# Altium schematic sheet L-D5019-05-02.SchDoc: EVE Display-Adapter
size A3; Organization: Organization; Address1: Address1; Address2: Address2; Address3: Address3; Address4: Address4; DocumentNumber: 1; Revision: 2; SheetNumber: 1; SheetTotal: 1; PageSetup: Record=PageOptions|CenterHorizontal=True|CenterVertical=True|PrintScale=1.00|XCorrection=1.00|YCorrection=1.00|PrintKind=1|BorderSize=5000000|LeftOffset=0|BottomOffset=0|Orientation=2|PaperLength=1000|PaperWidth=1000|Scale=100|PaperSource=7|PrintQuality=-4|MediaType=1|DitherType=10|PaperKind=A3|PrintScaleMode=0
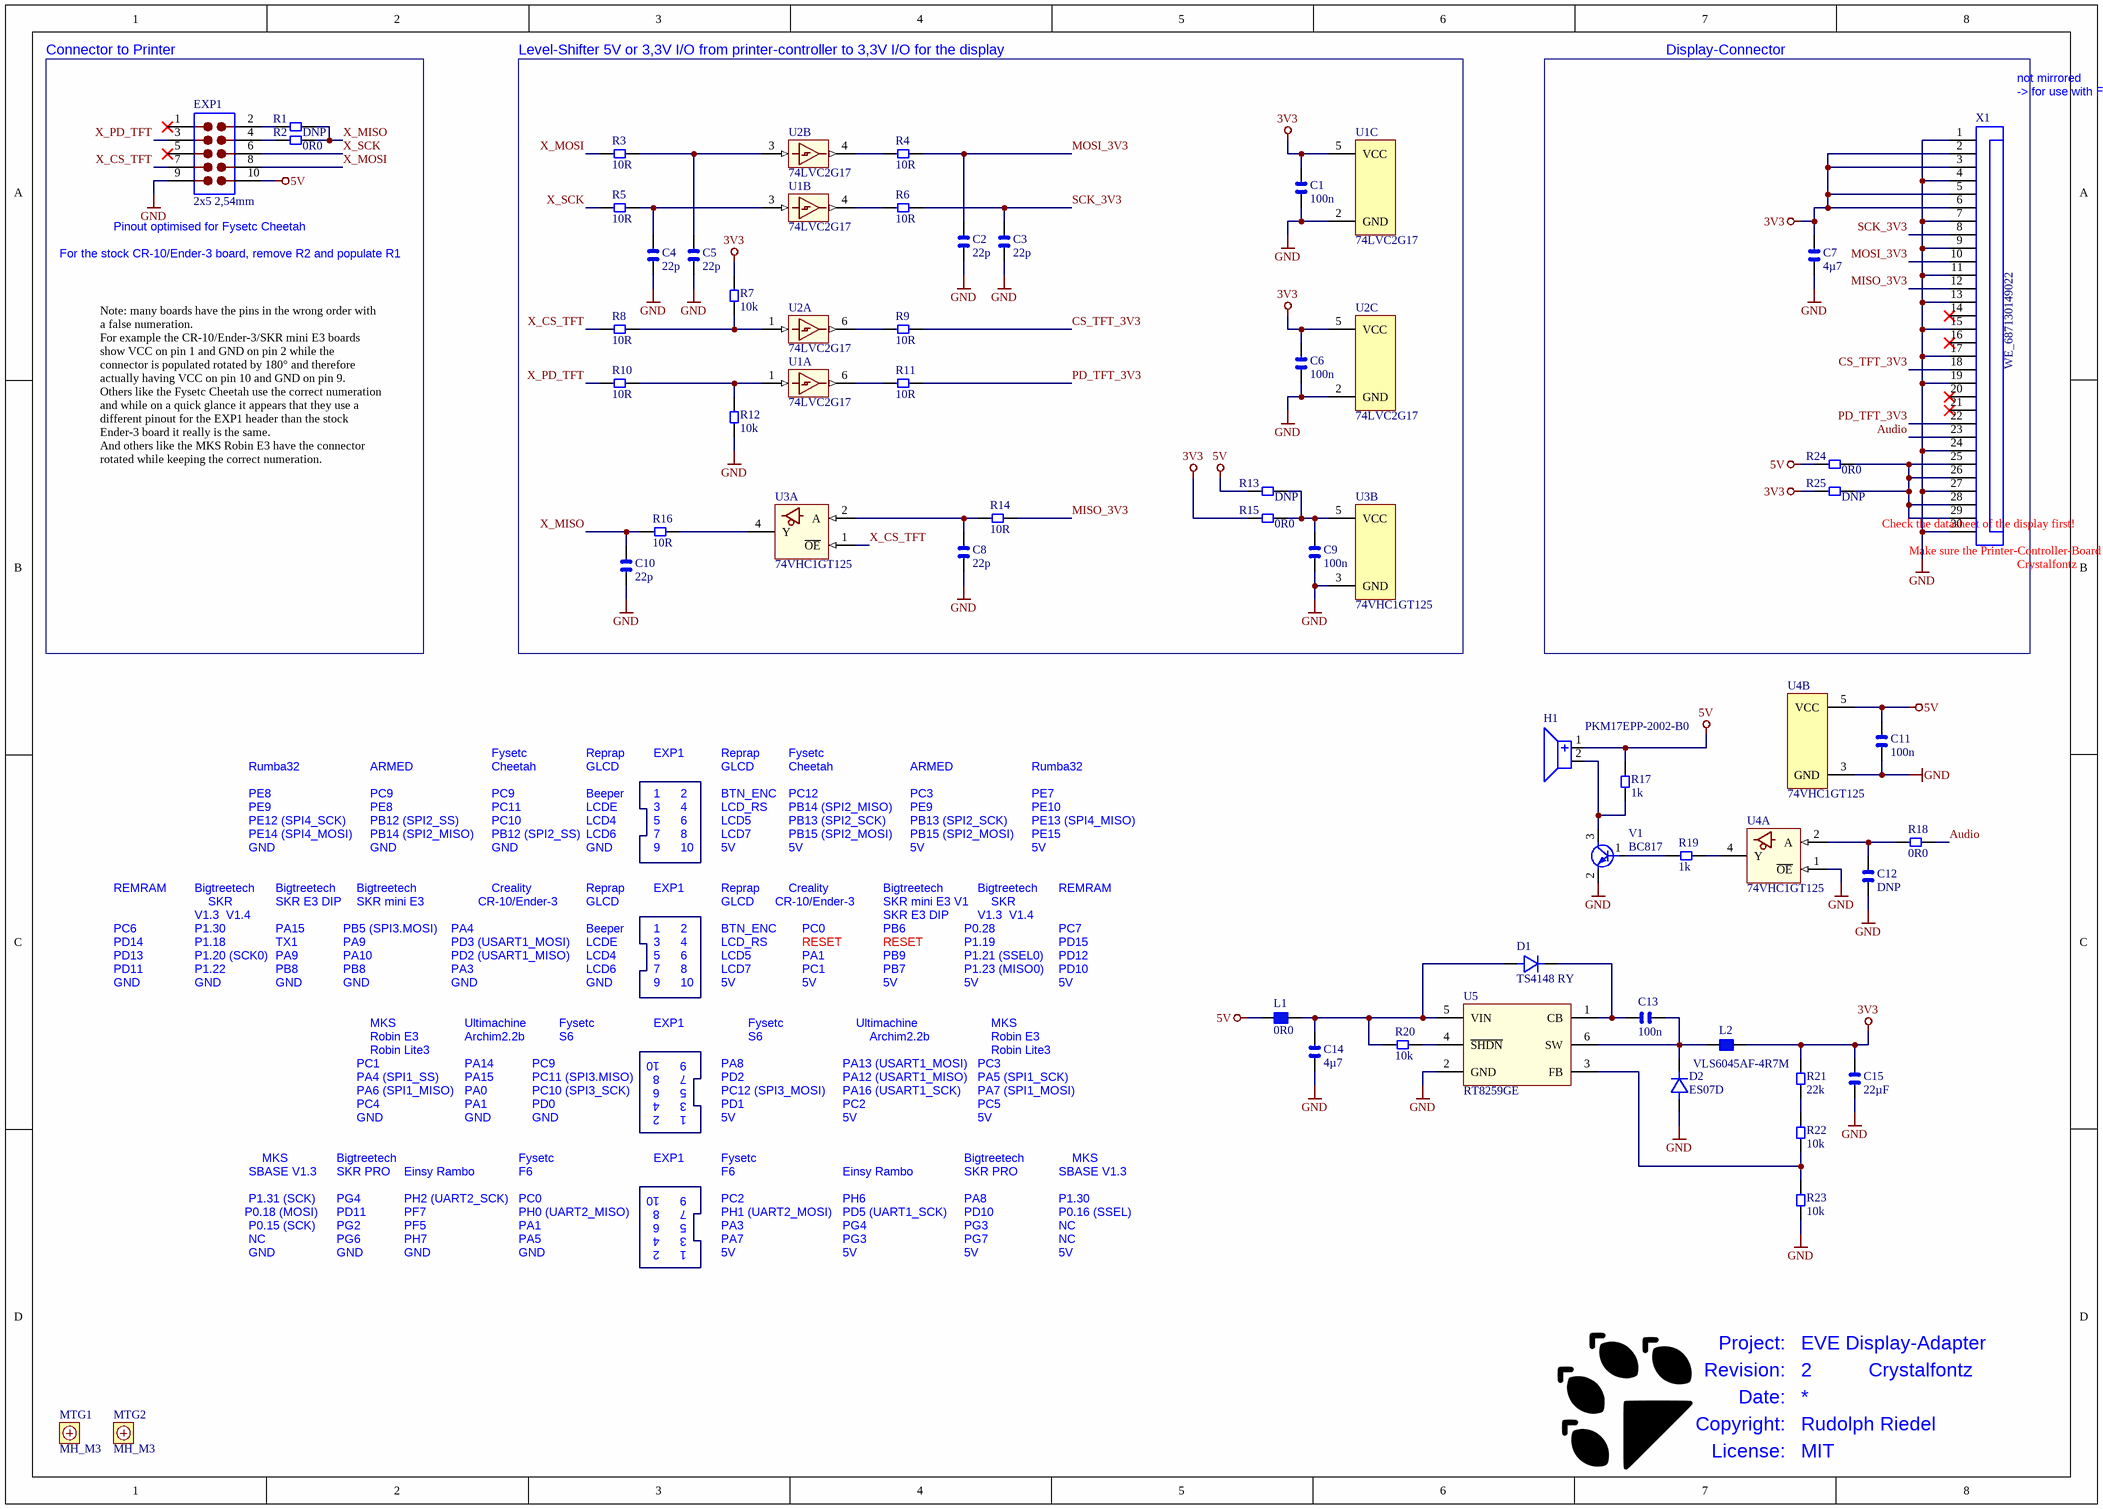
[diagram p0: L-D5019-05-02.SchDoc]

## Parts
C1  100n  [CAPC2012X14L]
C2  22p  [CAPC2012X14L]
C3  22p  [CAPC2012X14L]
C4  22p  [CAPC2012X14L]
C5  22p  [CAPC2012X14L]
C6  100n  [CAPC2012X14L]
C7  4µ7  [CAPC2012X14L]
C8  22p  [CAPC2012X14L]
C9  100n  [CAPC2012X14L]
C10  22p  [CAPC2012X14L]
C11  100n  [CAPC2012X14L]
C12  DNP  [CAPC2012X14L]
C13  100n  [CAPC2012X14L]
C14  4µ7  [CAPC2012X14L]
C15  22µF  [CAPC3216X19N]
D1  TS4148 RY  [DIOC2012X10N]
D2  ES07D  [DIOM2818X11N]
EXP1  2x5 2,54mm  [PINH_2x5_2_54mm_shroud]
H1  PKM17EPP-2002-B0  [Speaker_17mm]
L1  0R0  [INDC2012X10L]
L2  VLS6045AF-4R7M  [PowerInductor_6x6]
MTG1  MH_M3  [HOLE_3_2MM]  (no BOM)
MTG2  MH_M3  [HOLE_3_2MM]  (no BOM)
R1  DNP  [RESC2012X06L]
R2  0R0  [RESC2012X06L]
R3  10R  [RESC2012X06L]
R4  10R  [RESC2012X06L]
R5  10R  [RESC2012X06L]
R6  10R  [RESC2012X06L]
R7  10k  [RESC2012X06L]
R8  10R  [RESC2012X06L]
R9  10R  [RESC2012X06L]
R10  10R  [RESC2012X06L]
R11  10R  [RESC2012X06L]
R12  10k  [RESC2012X06L]
R13  DNP  [RESC2012X06L]
R14  10R  [RESC2012X06L]
R15  0R0  [RESC2012X06L]
R16  10R  [RESC2012X06L]
R17  1k  [RESC2012X06L]
R18  0R0  [RESC2012X06L]
R19  1k  [RESC2012X06L]
R20  10k  [RESC2012X06L]
R21  22k  [RESC2012X06L]
R22  10k  [RESC2012X06L]
R23  10k  [RESC2012X06L]
R24  0R0  [RESC2012X06L]
R25  DNP  [RESC2012X06L]
U1  74LVC2G17  [SOT95P280X110-6N]  (parts A,B,C of 3)
U2  74LVC2G17  [SOT95P280X110-6N]  (parts A,B,C of 3)
U3  74VHC1GT125  [SOT95P280X110-5N]  (parts A,B of 2)
U4  74VHC1GT125  [SOT95P280X110-5N]  (parts A,B of 2)
U5  RT8259GE  [SOT95P280X110-6N]
V1  BC817  [SOT95P280X110-3N]
X1  WE_687130149022  [WE_687130149022]

## Blocks framed on the sheet
Connector to Printer: EXP1 R1 R2
Display-Connector: C7 R24 R25 X1

## Nets
3V3: C1.2 C6.2 C7.2 C15.2 L2.2 R7.2 R15.1 R21.2 R25.1 U1.5(VCC) U2.5(VCC) X1.2 X1.3 X1.5 X1.6
5V: C11.2 EXP1.10 H1.1 L1.1 R13.1 R17.2 R24.1 U4.5(VCC)
GND: C1.1 C2.1 C3.1 C4.1 C5.1 C6.1 C7.1 C8.1 C9.1 C10.1 C11.1 C12.1 C14.1 C15.1 D2.2 EXP1.9 R12.1 R23.1 U1.2(GND) U2.2(GND) U3.3(GND) U4.1(~{OE}) U4.3(GND) U5.2(GND) V1.2 X1.1 X1.4 X1.7 X1.9 X1.11 X1.13 X1.15 X1.17 X1.19 X1.24 X1.27 X1.30
Audio: R18.2 X1.23
CS_TFT_3V3: R9.2 X1.18
MISO_3V3: R14.2 X1.12
MOSI_3V3: C2.2 R4.2 X1.10
PD_TFT_3V3: R11.2 X1.22
SCK_3V3: C3.2 R6.2 X1.8
X_CS_TFT: EXP1.7 R8.1 U3.1(~{OE})
X_MISO: C10.2 R1.2 R2.2 R16.1
X_MOSI: EXP1.8 R3.1
X_PD_TFT: EXP1.3 R10.1
X_SCK: EXP1.6 R5.1
NetC4_2: C4.2 R5.2 U1.3(2A)
NetC5_2: C5.2 R3.2 U2.3(2A)
NetC8_2: C8.2 R14.1 U3.2(A)
NetC9_2: C9.2 R13.2 R15.2 U3.5(VCC)
NetC12_2: C12.2 R18.1 U4.2(A)
NetC13_1: C13.1 D1.1 U5.1(CB)
NetC13_2: C13.2 D2.1 L2.1 U5.6(SW)
NetC14_2: C14.2 D1.2 L1.2 R20.1 U5.5(VIN)
NetEXP1_2: EXP1.2 R1.1
NetEXP1_4: EXP1.4 R2.1
NetH1_2: H1.2 R17.1 V1.3
NetR4_1: R4.1 U2.4(2Y)
NetR6_1: R6.1 U1.4(2Y)
NetR7_1: R7.1 R8.2 U2.1(1A)
NetR9_1: R9.1 U2.6(1Y)
NetR10_2: R10.2 R12.2 U1.1(1A)
NetR11_1: R11.1 U1.6(1Y)
NetR16_2: R16.2 U3.4(Y)
NetR19_1: R19.1 U4.4(Y)
NetR19_2: R19.2 V1.1
NetR20_2: R20.2 U5.4(~{SHDN})
NetR21_1: R21.1 R22.2
NetR22_1: R22.1 R23.2 U5.3(FB)
NetR24_2: R24.2 R25.2 X1.25 X1.26 X1.28 X1.29

Not connected (* = marked no-connect by the designer): EXP1 1* 5*; X1 14* 16* 20* 21*

## Notes on the sheet
- Level-Shifter 5V or 3,3V I/O from printer-controller to 3,3V I/O for the display
- (near X1) -> for use with FCC cable with connections on opposite sides
- not mirrored
- (near EXP1) Pinout optimised for Fysetc Cheetah
- For the stock CR-10/Ender-3 board, remove R2 and populate R1
- Note: many boards have the pins in the wrong order with a false numeration.
  For example the CR-10/Ender-3/SKR mini E3 boards show VCC on pin 1 and GND on pin 2 while the connector is populated rotated by 180° and therefore actually having VCC on pin 10 and GND on pin 9.
  Others like the Fysetc Cheetah use the correct numeration and while on a quick glance it appears that they use a different pinout for the EXP1 header than the stock Ender-3 board it really is the same.
  And others like the MKS Robin E3 have the connector rotated while keeping the correct numeration.
- (near R25) Check the datasheet of the display first!
- Make sure the Printer-Controller-Board can deliver enough current!
- (near X1) Crystalfontz
- Rumba32
- ARMED
- Cheetah
- Fysetc
- Reprap
- GLCD
- EXP1
- GND
- PE8
- PE9
- PE12 (SPI4_SCK)
- PE14 (SPI4_MOSI)
- PC9
- PB12 (SPI2_SS)
- PB14 (SPI2_MISO)
- PC10
- PC11
- Beeper
- LCDE
- LCD4
- LCD6
- 1
- 3
- 5
- 7
- 9
- 2
- 4
- 6
- 8
- 10
- BTN_ENC
- LCD_RS
- 5V
- LCD5
- LCD7
- PB13 (SPI2_SCK)
- PB15 (SPI2_MOSI)
- PC12
- PC3
- PE10
- PE13 (SPI4_MISO)
- PE15
- PE7
- REMRAM
- Bigtreetech
- V1.3  V1.4
- SKR
- SKR E3 DIP
- SKR mini E3
- CR-10/Ender-3
- Creality
- SKR mini E3 V1
- PC6
- PD14
- PD13
- PD11
- P1.30
- P1.18
- P1.20 (SCK0)
- P1.22
- PA15
- TX1
- PA9
- PB8
- PA10
- PB5 (SPI3.MOSI)
- PA4
- PD3 (USART1_MOSI)
- PD2 (USART1_MISO)
- PA3
- PC0
- RESET
- PA1
- PC1
- PB7
- PB9
- PB6
- P0.28
- P1.19
- P1.21 (SSEL0)
- P1.23 (MISO0)
- PC7
- PD15
- PD12
- PD10
- MKS
- Robin E3
- Robin Lite3
- Archim2.2b
- Ultimachine
- S6
- PC4
- PA6 (SPI1_MISO)
- PA4 (SPI1_SS)
- PA14
- PA0
- PC11 (SPI3.MISO)
- PC10 (SPI3_SCK)
- PD0
- PD1
- PC12 (SPI3_MOSI)
- PD2
- PA8
- PA16 (USART1_SCK)
- PA13 (USART1_MOSI)
- PA12 (USART1_MISO)
- PC2
- PC5
- PA7 (SPI1_MOSI)
- PA5 (SPI1_SCK)
- SBASE V1.3
- SKR PRO
- Einsy Rambo
- F6
- P0.18 (MOSI)
- P1.31 (SCK)
- NC
- P0.15 (SCK)
- PG6
- PG2
- PG4
- PH7
- PF5
- PF7
- PH2 (UART2_SCK)
- PA5
- PH0 (UART2_MISO)
- PH1 (UART2_MOSI)
- PA7
- PG3
- PD5 (UART1_SCK)
- PH6
- PG7
- P0.16 (SSEL)
- Crystalfontz
- Project:
- Revision:
- Date:
- Copyright:
- License:
- Rudolph Riedel
- MIT

## Library data of the parts
C1-C6 C8-C13 = CAPC_0805: 0805 Chip Capacitor; Editor: rriedel; Kategorie: generic; Unterart: unpolarized; Part Number: CAPC_0805; Status: tested; Bauteilart: Capacitor; PackageDescription: 0805
  C1 C6 C9 C11 C13: Value: 100n
  C2-C5 C8 C10: Value: 22p
  C12: Value: DNP
C7 C14 = CAPC_0805: 0805 Chip Capacitor; Editor: rriedel; Subgroup: unpolarized; Part Number: CAPC_0805; Value: 4µ7; Status: tested; Category: generic; Group: Capacitor; PackageDescription: 0805
C15 = CAPC_1206: 1206 Chip Capacitor; Editor: rriedel; Kategorie: generic; Unterart: unpolarized; Part Number: CAPC_1206; Value: 22µF; Status: tested; Bauteilart: Capacitor; PackageDescription: 1206
D1 = TSC_TS4148 RY: Small Signal Diode IF 0.3A, VR 75V, 0805; Manufacturer: TSC; Editor: rriedel; Kategorie: Part; Part Number: TSC_TS4148 RY; Value: TS4148 RY; Status: tested; Date: 09.10.2013; Bauteilart: Diode; Unterart: Small Signal; PackageDescription: 0805; Part_Number_1: TS4148 RY
D2 = ES07D: Ultrafast Rectifier Surface Mount,  IF 0.5A, VR 100V, DO-219AB, AEC-Q101; Manufacturer: Vishay; Editor: rriedel; Kategorie: Part; Bauteilart: Diode; Part Number: ES07D; Value: ES07D; Status: tested; Date: 09.10.2013; Unterart: Rectifier; PackageDescription: DO-219AB; Part_Number_1: ES07D
EXP1 = PINH_2x5_2_54: Pin-Header 2,54 mm 2x5pins, shrouded; Editor: rriedel; Kategorie: generic; Bauteilart: Connector; Part Number: PINH_2x5_2_54; Value: 2x5 2,54mm; Status: tested; Date: 31.03.2019; Unterart: Pin-Header
H1 = PKM17EPP-2002-B0: Speaker, Piezo, THT, dia 17mm,  height 8.6 mm; Manufacturer: Murata; Editor: rriedel; Kategorie: Part; Bauteilart: Electromechanical; Part Number: PKM17EPP-2002-B0; Value: PKM17EPP-2002-B0; Status: new; Date: 23.05.2020; Unterart: Speaker; PackageDescription: THT, 12mm dia; Part_Number_1: PKM17EPP-2002-B0; Distributor_1: Digi-Key; Distributor_1_Part_Number: 490-4688-ND
L1 = INDC_0805: 0805 Chip Inductor; Editor: rriedel; Kategorie: generic; Part Number: INDC_0805; Value: 0R0; Status: tested; Date: 31.03.2019; Bauteilart: Inductor; Unterart: generic; PackageDescription: 0805
L2 = VLS6045AF-4R7M: 4,7µH, shielded, 4,7A, 26mR; Manufacturer: TDK; Editor: rriedel; Kategorie: Part; Bauteilart: Inductor; Unterart: Power; Part Number: VLS6045AF-4R7M; Value: VLS6045AF-4R7M; Status: tested; Date: 31.03.2019; PackageDescription: 6x6 mm; Part_Number_1: VLS6045AF-4R7M; Distributor_1: Digi-Key; Distributor_1_Part_Number: 445-180835-1-ND
MTG1 MTG2 = MH_M3: Mounting-Hole for M3 screws; Editor: rriedel; Kategorie: No_Bom; Bauteilart: Mechanic; Unterart: Holes; Part Number: MH_M3; Value: MH_M3; Status: tested; Date: 13.05.2018
R1-R25 = RESC_0805: 0805 Chip Resistor; Editor: rriedel; Kategorie: generic; Part Number: RESC_0805; Status: tested; Bauteilart: Resistor; Unterart: generic; PackageDescription: 0805
  R1 R13 R25: Value: DNP
  R2 R15 R18 R24: Value: 0R0
  R3-R6 R8-R11 R14 R16: Value: 10R
  R7 R12 R20 R22 R23: Value: 10k
  R17 R19: Value: 1k
  R21: Value: 22k
U1 U2 = 74LVC2G17: Dual Schmitt-Trigger Buffer with 5.5V tolerant inputs; Manufacturer: TI; Part_Number_1: 74LVC2G17DBVR; Editor: rriedel; Kategorie: Part; Bauteilart: IC; Unterart: Logic; Part Number: 74LVC2G17; Value: 74LVC2G17; Status: tested; Date: 08.05.2020; PackageDescription: SOT23-6; Distributor_1: Digi-Key; Distributor_1_Part_Number: 296-SN74LVC2G17DBVRCT-ND‎
U3 U4 = 74VHC1GT125: 1x Buffer with OE; 3-state,Level Shifter 3,3V to 5V and 5V to 3.3V; Manufacturer: ON Semiconductor; Part_Number_1: M74VHC1G125DT1G; Editor: rriedel; Kategorie: Part; Bauteilart: IC; Unterart: Logic; Part Number: 74VHC1GT125; Value: 74VHC1GT125; Status: tested; Date: 21.01.2011; PackageDescription: SOT23-5; Distributor_1: Farnell; Distributor_1_Part_Number: 1703291
U5 = RT8259GE: Step-Down DC/DC Regulator, 24V, 1.2A, 1,4MHz; Manufacturer: Richtek; Editor: rriedel; Kategorie: Part; Bauteilart: IC; Unterart: Switching-Regulators; Part Number: RT8259GE; Value: RT8259GE; Status: tested; Date: 31.03.2019; PackageDescription: SOT23-6; Part_Number_1: RT8259GE; Distributor_1: Digi-Key; Distributor_1_Part_Number: 1028-1497-1-ND
V1 = BC817: NPN Transistor SOT23, 1=B, 2=C, 3=E; Editor: rriedel; Kategorie: Part; Part Number: BC817; Value: BC817; Status: tested; Date: 23.05.2020; Bauteilart: Transistor; Unterart: NPN; PackageDescription: SOT23
X1 = WE_687130149022: 30pin WR-FPC 0.50 mm SMT ZIF Horizontal - Bottom Contact; Manufacturer: Wuerth; Part_Number_1: 6.8713014902e+011; Editor: rriedel; Kategorie: Part; Bauteilart: Connector; Unterart: FPC; Part Number: WE_687130149022; Value: WE_687130149022; Status: tested; Date: 25.05.2020; PackageDescription: FPC 0.5mm; Distributor_1: Digi-Key; Distributor_1_Part_Number: 732-6007-1-ND